# Altium schematic sheet MCU.SchDoc
size A3; SheetNumber: 2; SheetTotal: 5
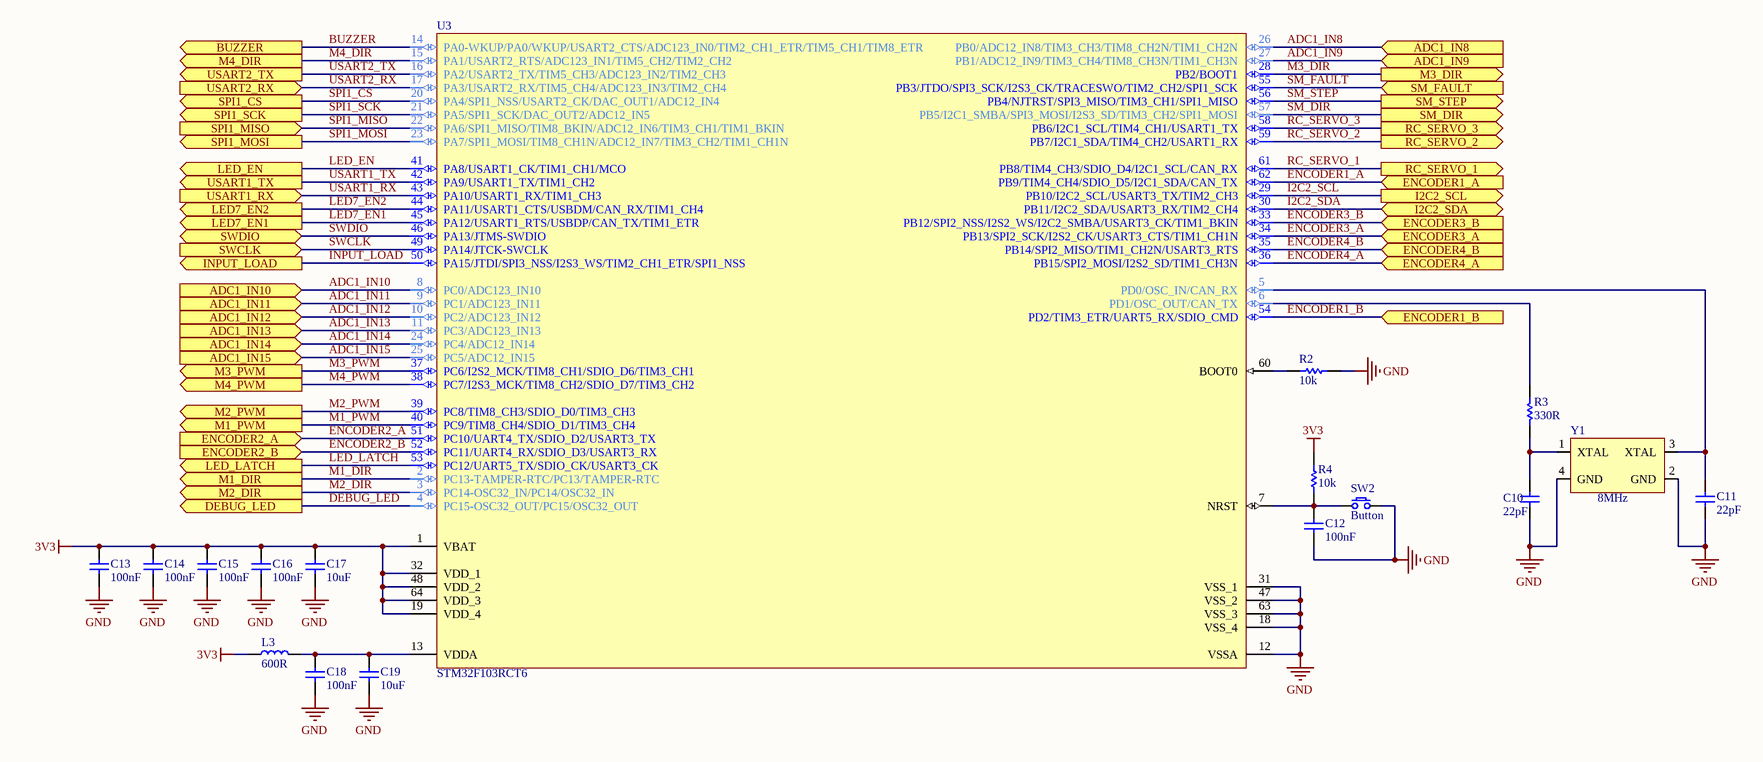
[diagram p0: MCU.SchDoc]

## Parts
C10  22pF  [C 0603 (1608)]
C11  22pF  [C 0603 (1608)]
C12  100nF  [C 0603 (1608)]
C13  100nF  [C 0603 (1608)]
C14  100nF  [C 0603 (1608)]
C15  100nF  [C 0603 (1608)]
C16  100nF  [C 0603 (1608)]
C17  10uF  [C 0603 (1608)]
C18  100nF  [C 0603 (1608)]
C19  10uF  [C 0603 (1608)]
L3  600R  [L 0603 (1608)]
R2  10k  [R 0603 (1608)]
R3  330R  [R 0603 (1608)]
R4  10k  [R 0603 (1608)]
SW2  Button  [SW/2/SMD - 6X6X5]
U3  STM32F103RCT6  [LQFP64_N]
Y1  8MHz  [Crystal SMD 4PIN 3225]

## Ports
ADC1_IN8 (in), ADC1_IN9 (in), ADC1_IN10 (in), ADC1_IN11 (in), ADC1_IN12 (in), ADC1_IN13 (in), ADC1_IN14 (in), ADC1_IN15 (in), BUZZER (out), DEBUG_LED (out), ENCODER1_A (in), ENCODER1_B (in), ENCODER2_A (in), ENCODER2_B (in), ENCODER3_A (in), ENCODER3_B (in), ENCODER4_A (in), ENCODER4_B (in), I2C2_SCL (out), I2C2_SDA (bidir), INPUT_LOAD (out), LED7_EN1 (out), LED7_EN2 (out), LED_EN (out), LED_LATCH (out), M1_DIR (out), M1_PWM (out), M2_DIR (out), M2_PWM (out), M3_DIR (out), M3_PWM (out), M4_DIR (out), M4_PWM (out), RC_SERVO_1 (out), RC_SERVO_2 (out), RC_SERVO_3 (out), SM_DIR (out), SM_FAULT (in), SM_STEP (out), SPI1_CS (out), SPI1_MISO (in), SPI1_MOSI (out), SPI1_SCK (out), SWCLK (in), SWDIO (bidir), USART1_RX (in), USART1_TX (out), USART2_RX (in), USART2_TX (out)

## Nets
3V3: C13.1 C14.1 C15.1 C16.1 C17.1 L3.2 R4.1 U3.1(VBAT) U3.19(VDD_4) U3.32(VDD_1) U3.48(VDD_2) U3.64(VDD_3)
GND: C10.2 C11.2 C12.2 C13.2 C14.2 C15.2 C16.2 C17.2 C18.2 C19.2 R2.1 SW2.2 U3.12(VSSA) U3.18(VSS_4) U3.31(VSS_1) U3.47(VSS_2) U3.63(VSS_3) Y1.2(GND) Y1.4(GND)
ADC1_IN8: U3.26(PB0/ADC12_IN8/TIM3_CH3/TIM8_CH2N/TIM1_CH2N) ; port ADC1_IN8
ADC1_IN9: U3.27(PB1/ADC12_IN9/TIM3_CH4/TIM8_CH3N/TIM1_CH3N) ; port ADC1_IN9
ADC1_IN10: U3.8(PC0/ADC123_IN10) ; port ADC1_IN10
ADC1_IN11: U3.9(PC1/ADC123_IN11) ; port ADC1_IN11
ADC1_IN12: U3.10(PC2/ADC123_IN12) ; port ADC1_IN12
ADC1_IN13: U3.11(PC3/ADC123_IN13) ; port ADC1_IN13
ADC1_IN14: U3.24(PC4/ADC12_IN14) ; port ADC1_IN14
ADC1_IN15: U3.25(PC5/ADC12_IN15) ; port ADC1_IN15
BUZZER: U3.14(PA0-WKUP/PA0/WKUP/USART2_CTS/ADC123_IN0/TIM2_CH1_ETR/TIM5_CH1/TIM8_ETR) ; port BUZZER
DEBUG_LED: U3.4(PC15-OSC32_OUT/PC15/OSC32_OUT) ; port DEBUG_LED
ENCODER1_A: U3.62(PB9/TIM4_CH4/SDIO_D5/I2C1_SDA/CAN_TX) ; port ENCODER1_A
ENCODER1_B: U3.54(PD2/TIM3_ETR/UART5_RX/SDIO_CMD) ; port ENCODER1_B
ENCODER2_A: U3.51(PC10/UART4_TX/SDIO_D2/USART3_TX) ; port ENCODER2_A
ENCODER2_B: U3.52(PC11/UART4_RX/SDIO_D3/USART3_RX) ; port ENCODER2_B
ENCODER3_A: U3.34(PB13/SPI2_SCK/I2S2_CK/USART3_CTS/TIM1_CH1N) ; port ENCODER3_A
ENCODER3_B: U3.33(PB12/SPI2_NSS/I2S2_WS/I2C2_SMBA/USART3_CK/TIM1_BKIN) ; port ENCODER3_B
ENCODER4_A: U3.36(PB15/SPI2_MOSI/I2S2_SD/TIM1_CH3N) ; port ENCODER4_A
ENCODER4_B: U3.35(PB14/SPI2_MISO/TIM1_CH2N/USART3_RTS) ; port ENCODER4_B
I2C2_SCL: U3.29(PB10/I2C2_SCL/USART3_TX/TIM2_CH3) ; port I2C2_SCL
I2C2_SDA: U3.30(PB11/I2C2_SDA/USART3_RX/TIM2_CH4) ; port I2C2_SDA
INPUT_LOAD: U3.50(PA15/JTDI/SPI3_NSS/I2S3_WS/TIM2_CH1_ETR/SPI1_NSS) ; port INPUT_LOAD
LED7_EN1: U3.45(PA12/USART1_RTS/USBDP/CAN_TX/TIM1_ETR) ; port LED7_EN1
LED7_EN2: U3.44(PA11/USART1_CTS/USBDM/CAN_RX/TIM1_CH4) ; port LED7_EN2
LED_EN: U3.41(PA8/USART1_CK/TIM1_CH1/MCO) ; port LED_EN
LED_LATCH: U3.53(PC12/UART5_TX/SDIO_CK/USART3_CK) ; port LED_LATCH
M1_DIR: U3.2(PC13-TAMPER-RTC/PC13/TAMPER-RTC) ; port M1_DIR
M1_PWM: U3.40(PC9/TIM8_CH4/SDIO_D1/TIM3_CH4) ; port M1_PWM
M2_DIR: U3.3(PC14-OSC32_IN/PC14/OSC32_IN) ; port M2_DIR
M2_PWM: U3.39(PC8/TIM8_CH3/SDIO_D0/TIM3_CH3) ; port M2_PWM
M3_DIR: U3.28(PB2/BOOT1) ; port M3_DIR
M3_PWM: U3.37(PC6/I2S2_MCK/TIM8_CH1/SDIO_D6/TIM3_CH1) ; port M3_PWM
M4_DIR: U3.15(PA1/USART2_RTS/ADC123_IN1/TIM5_CH2/TIM2_CH2) ; port M4_DIR
M4_PWM: U3.38(PC7/I2S3_MCK/TIM8_CH2/SDIO_D7/TIM3_CH2) ; port M4_PWM
RC_SERVO_1: U3.61(PB8/TIM4_CH3/SDIO_D4/I2C1_SCL/CAN_RX) ; port RC_SERVO_1
RC_SERVO_2: U3.59(PB7/I2C1_SDA/TIM4_CH2/USART1_RX) ; port RC_SERVO_2
RC_SERVO_3: U3.58(PB6/I2C1_SCL/TIM4_CH1/USART1_TX) ; port RC_SERVO_3
SM_DIR: U3.57(PB5/I2C1_SMBA/SPI3_MOSI/I2S3_SD/TIM3_CH2/SPI1_MOSI) ; port SM_DIR
SM_FAULT: U3.55(PB3/JTDO/SPI3_SCK/I2S3_CK/TRACESWO/TIM2_CH2/SPI1_SCK) ; port SM_FAULT
SM_STEP: U3.56(PB4/NJTRST/SPI3_MISO/TIM3_CH1/SPI1_MISO) ; port SM_STEP
SPI1_CS: U3.20(PA4/SPI1_NSS/USART2_CK/DAC_OUT1/ADC12_IN4) ; port SPI1_CS
SPI1_MISO: U3.22(PA6/SPI1_MISO/TIM8_BKIN/ADC12_IN6/TIM3_CH1/TIM1_BKIN) ; port SPI1_MISO
SPI1_MOSI: U3.23(PA7/SPI1_MOSI/TIM8_CH1N/ADC12_IN7/TIM3_CH2/TIM1_CH1N) ; port SPI1_MOSI
SPI1_SCK: U3.21(PA5/SPI1_SCK/DAC_OUT2/ADC12_IN5) ; port SPI1_SCK
SWCLK: U3.49(PA14/JTCK-SWCLK) ; port SWCLK
SWDIO: U3.46(PA13/JTMS-SWDIO) ; port SWDIO
USART1_RX: U3.43(PA10/USART1_RX/TIM1_CH3) ; port USART1_RX
USART1_TX: U3.42(PA9/USART1_TX/TIM1_CH2) ; port USART1_TX
USART2_RX: U3.17(PA3/USART2_RX/TIM5_CH4/ADC123_IN3/TIM2_CH4) ; port USART2_RX
USART2_TX: U3.16(PA2/USART2_TX/TIM5_CH3/ADC123_IN2/TIM2_CH3) ; port USART2_TX
NetC10_1: C10.1 R3.1 Y1.1(XTAL)
NetC11_1: C11.1 U3.5(PD0/OSC_IN/CAN_RX) Y1.3(XTAL)
NetC12_1: C12.1 R4.2 SW2.1 U3.7(NRST)
NetC18_1: C18.1 C19.1 L3.1 U3.13(VDDA)
NetR2_2: R2.2 U3.60(BOOT0)
NetR3_2: R3.2 U3.6(PD1/OSC_OUT/CAN_TX)

## Library data of the parts
C10-C19 = Capacitor NP: Capacitor non-pol
L3 = Inductor
R2-R4 = Resistor: Published: 8-Jun-2000; LatestRevisionDate: 17-Jul-2002; LatestRevisionNote: Re-released for DXP Platform.; PackageReference: AXIAL-0.3; Publisher: Altium Limited
SW2 = SW SPST: Tact switch 2 pin
U3 = STM32F103RCT6: ARM Cortex-M3 32-bit MCU, 256 KB Flash, 48 KB Internal RAM, 51 I/Os, 64-pin LQFP, -40 to 85 degC, Tray; A/D Converter: 3x12-bit (16 Channel); D/A Converter: 2x12-bit (2 Channel); FLASH Size (Prog) (kB): 256; I/Os (High Current): 51; Internal RAM Size (kB): 48; Operating Frequency(F) (Processor speed) (MHz): 72; Supply Voltage(Vcc) min (V): 2; DatasheetVersion: Rev. 8; PackageVersion: Rev. 4, 06/2013; PackageReference: LQFP64; PackageDescription: 64-Pin Low Profile Quad Flat Package, 10 x 10 mm Body, 0.5 mm Pitch; Supplier 1: Digi-Key; Supplier Part Number 1: 497-9033-ND; Supplier 2: Newark; Supplier Part Number 2: 01P4099; Supplier 3: Newark; Supplier Part Number 3: 57P1227; Supplier 4: Mouser; Supplier Part Number 4: 511-STM32F103RCT6; Core: ARM Cortex-M3; Packing: Tray; Mounting Technology: Surface Mount; PartNumber: STM32F103RCT6; ComponentLink1Description: Manufacturer URL; ComponentLink1URL: http://www.st.com/web/en/home.html; ComponentLink2Description: Datasheet; ComponentLink2URL: http://www.st.com/st-web-ui/static/active/en/resource/technical/document/datasheet/CD00191185.pdf; ComponentLink3Description: Package Specification; ComponentLink3URL: http://www.st.com/st-web-ui/static/active/en/resource/technical/document/datasheet/DM00037051.pdf
Y1 = Crystal 4pin